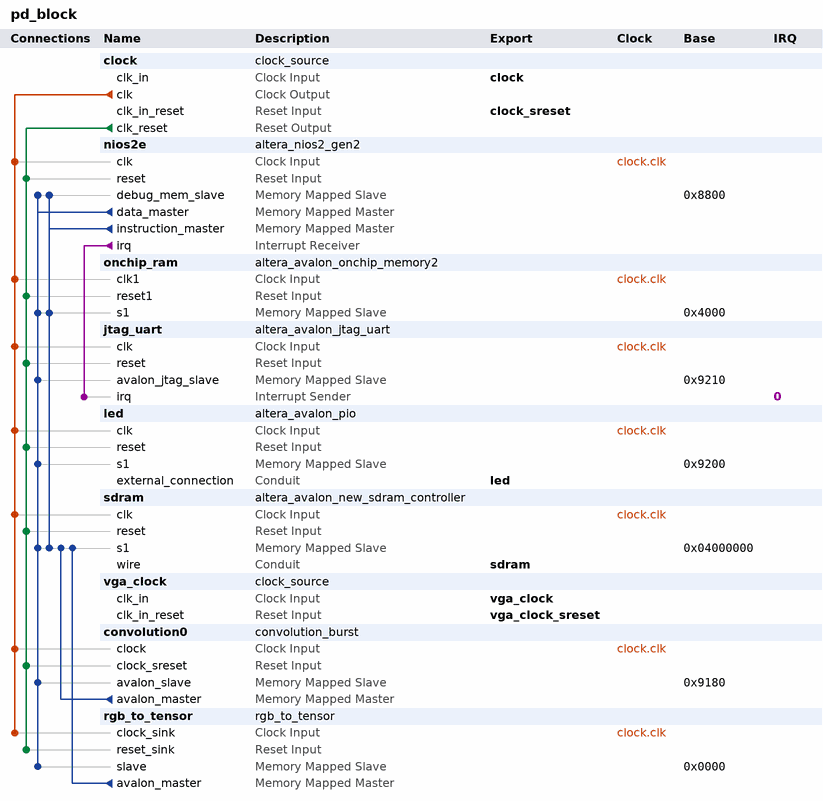
[diagram p0: system contents]
# Platform Designer (Qsys) system pd_block, MAX 10 10M50DAF484C7G
# Parameters at their usual value, and those the tool derives, are not listed.
package require -exact qsys 18.1
create_system pd_block
set_project_property DEVICE_FAMILY {MAX 10}
set_project_property DEVICE 10M50DAF484C7G

add_instance clock clock_source 18.1
set_instance_parameter_value clock clockFrequency 100000000
set_instance_parameter_value clock resetSynchronousEdges BOTH

add_instance nios2e altera_nios2_gen2 18.1
set_instance_parameter_value nios2e dcache_size 2048
set_instance_parameter_value nios2e exceptionSlave onchip_ram.s1
set_instance_parameter_value nios2e icache_size 4096
set_instance_parameter_value nios2e impl Tiny
set_instance_parameter_value nios2e resetSlave onchip_ram.s1

add_instance onchip_ram altera_avalon_onchip_memory2 18.1
set_instance_parameter_value onchip_ram dataWidth 32
set_instance_parameter_value onchip_ram dualPort false
set_instance_parameter_value onchip_ram initMemContent true
set_instance_parameter_value onchip_ram initializationFileName onchip_mem.hex
set_instance_parameter_value onchip_ram memorySize 16384

add_instance jtag_uart altera_avalon_jtag_uart 18.1
set_instance_parameter_value jtag_uart simInteractiveOptions NO_INTERACTIVE_WINDOWS

add_instance led altera_avalon_pio 18.1
set_instance_parameter_value led direction Output
set_instance_parameter_value led width 10

add_instance sdram altera_avalon_new_sdram_controller 18.1
set_instance_parameter_value sdram TAC 5.5
set_instance_parameter_value sdram TRCD 20.0
set_instance_parameter_value sdram TRP 20.0
set_instance_parameter_value sdram casLatency 2
set_instance_parameter_value sdram columnWidth 10
set_instance_parameter_value sdram dataWidth 16
set_instance_parameter_value sdram generateSimulationModel false
set_instance_parameter_value sdram model single_Micron_MT48LC4M32B2_7_chip
set_instance_parameter_value sdram numberOfBanks 4
set_instance_parameter_value sdram numberOfChipSelects 1
set_instance_parameter_value sdram powerUpDelay 100.0
set_instance_parameter_value sdram refreshPeriod 7.8125
set_instance_parameter_value sdram rowWidth 13

add_instance vga_clock clock_source 18.1
set_instance_parameter_value vga_clock clockFrequency 25000000
set_instance_parameter_value vga_clock resetSynchronousEdges BOTH

add_instance convolution0 convolution_burst 1.0
set_instance_parameter_value convolution0 ADDER_PIPELINE 1
set_instance_parameter_value convolution0 EXP 8
set_instance_parameter_value convolution0 FIFO_DEPTH 512
set_instance_parameter_value convolution0 KX 3
set_instance_parameter_value convolution0 KY 3
set_instance_parameter_value convolution0 MANT 7
set_instance_parameter_value convolution0 MAX_RES 256
set_instance_parameter_value convolution0 PAD 1
set_instance_parameter_value convolution0 RESOLUTIONS 5
set_instance_parameter_value convolution0 WIDTH 16
set_instance_parameter_value convolution0 WIDTHB 2
set_instance_parameter_value convolution0 WIDTHD 9
set_instance_parameter_value convolution0 WIDTHF 16
set_instance_parameter_value convolution0 XRES1 16
set_instance_parameter_value convolution0 XRES2 32
set_instance_parameter_value convolution0 XRES3 64
set_instance_parameter_value convolution0 XRES4 128
set_instance_parameter_value convolution0 XRES5 256
set_instance_parameter_value convolution0 YRES1 16
set_instance_parameter_value convolution0 YRES2 32
set_instance_parameter_value convolution0 YRES3 64
set_instance_parameter_value convolution0 YRES4 128
set_instance_parameter_value convolution0 YRES5 256

add_instance rgb_to_tensor rgb_to_tensor 1.0

# connections
add_connection clock.clk convolution0.clock clock
add_connection clock.clk jtag_uart.clk clock
add_connection clock.clk led.clk clock
add_connection clock.clk nios2e.clk clock
add_connection clock.clk onchip_ram.clk1 clock
add_connection clock.clk rgb_to_tensor.clock_sink clock
add_connection clock.clk sdram.clk clock
add_connection clock.clk_reset convolution0.clock_sreset reset
add_connection clock.clk_reset jtag_uart.reset reset
add_connection clock.clk_reset led.reset reset
add_connection clock.clk_reset nios2e.reset reset
add_connection clock.clk_reset onchip_ram.reset1 reset
add_connection clock.clk_reset rgb_to_tensor.reset_sink reset
add_connection clock.clk_reset sdram.reset reset
add_connection convolution0.avalon_master sdram.s1 avalon
set_connection_parameter_value convolution0.avalon_master/sdram.s1 baseAddress 0x04000000
add_connection nios2e.data_master convolution0.avalon_slave avalon
set_connection_parameter_value nios2e.data_master/convolution0.avalon_slave baseAddress 0x9180
add_connection nios2e.data_master jtag_uart.avalon_jtag_slave avalon
set_connection_parameter_value nios2e.data_master/jtag_uart.avalon_jtag_slave baseAddress 0x9210
add_connection nios2e.data_master led.s1 avalon
set_connection_parameter_value nios2e.data_master/led.s1 baseAddress 0x9200
add_connection nios2e.data_master nios2e.debug_mem_slave avalon
set_connection_parameter_value nios2e.data_master/nios2e.debug_mem_slave baseAddress 0x8800
add_connection nios2e.data_master onchip_ram.s1 avalon
set_connection_parameter_value nios2e.data_master/onchip_ram.s1 baseAddress 0x4000
add_connection nios2e.data_master rgb_to_tensor.slave avalon
set_connection_parameter_value nios2e.data_master/rgb_to_tensor.slave baseAddress 0x0000
add_connection nios2e.data_master sdram.s1 avalon
set_connection_parameter_value nios2e.data_master/sdram.s1 baseAddress 0x04000000
add_connection nios2e.instruction_master nios2e.debug_mem_slave avalon
set_connection_parameter_value nios2e.instruction_master/nios2e.debug_mem_slave baseAddress 0x8800
add_connection nios2e.instruction_master onchip_ram.s1 avalon
set_connection_parameter_value nios2e.instruction_master/onchip_ram.s1 baseAddress 0x4000
add_connection nios2e.instruction_master sdram.s1 avalon
set_connection_parameter_value nios2e.instruction_master/sdram.s1 baseAddress 0x04000000
add_connection rgb_to_tensor.avalon_master sdram.s1 avalon
set_connection_parameter_value rgb_to_tensor.avalon_master/sdram.s1 baseAddress 0x04000000
add_connection nios2e.irq jtag_uart.irq interrupt
set_connection_parameter_value nios2e.irq/jtag_uart.irq irqNumber 0

# exported interfaces
add_interface clock clock sink
set_interface_property clock EXPORT_OF clock.clk_in
add_interface clock_sreset reset sink
set_interface_property clock_sreset EXPORT_OF clock.clk_in_reset
add_interface led conduit end
set_interface_property led EXPORT_OF led.external_connection
add_interface sdram conduit end
set_interface_property sdram EXPORT_OF sdram.wire
add_interface vga_clock clock sink
set_interface_property vga_clock EXPORT_OF vga_clock.clk_in
add_interface vga_clock_sreset reset sink
set_interface_property vga_clock_sreset EXPORT_OF vga_clock.clk_in_reset

set_interconnect_requirement {$system} qsys_mm.clockCrossingAdapter HANDSHAKE
set_interconnect_requirement {$system} qsys_mm.enableEccProtection FALSE
set_interconnect_requirement {$system} qsys_mm.insertDefaultSlave FALSE
set_interconnect_requirement {$system} qsys_mm.maxAdditionalLatency 1

save_system pd_block.qsys
